# Altium schematic sheet uARM.SchDoc
size B
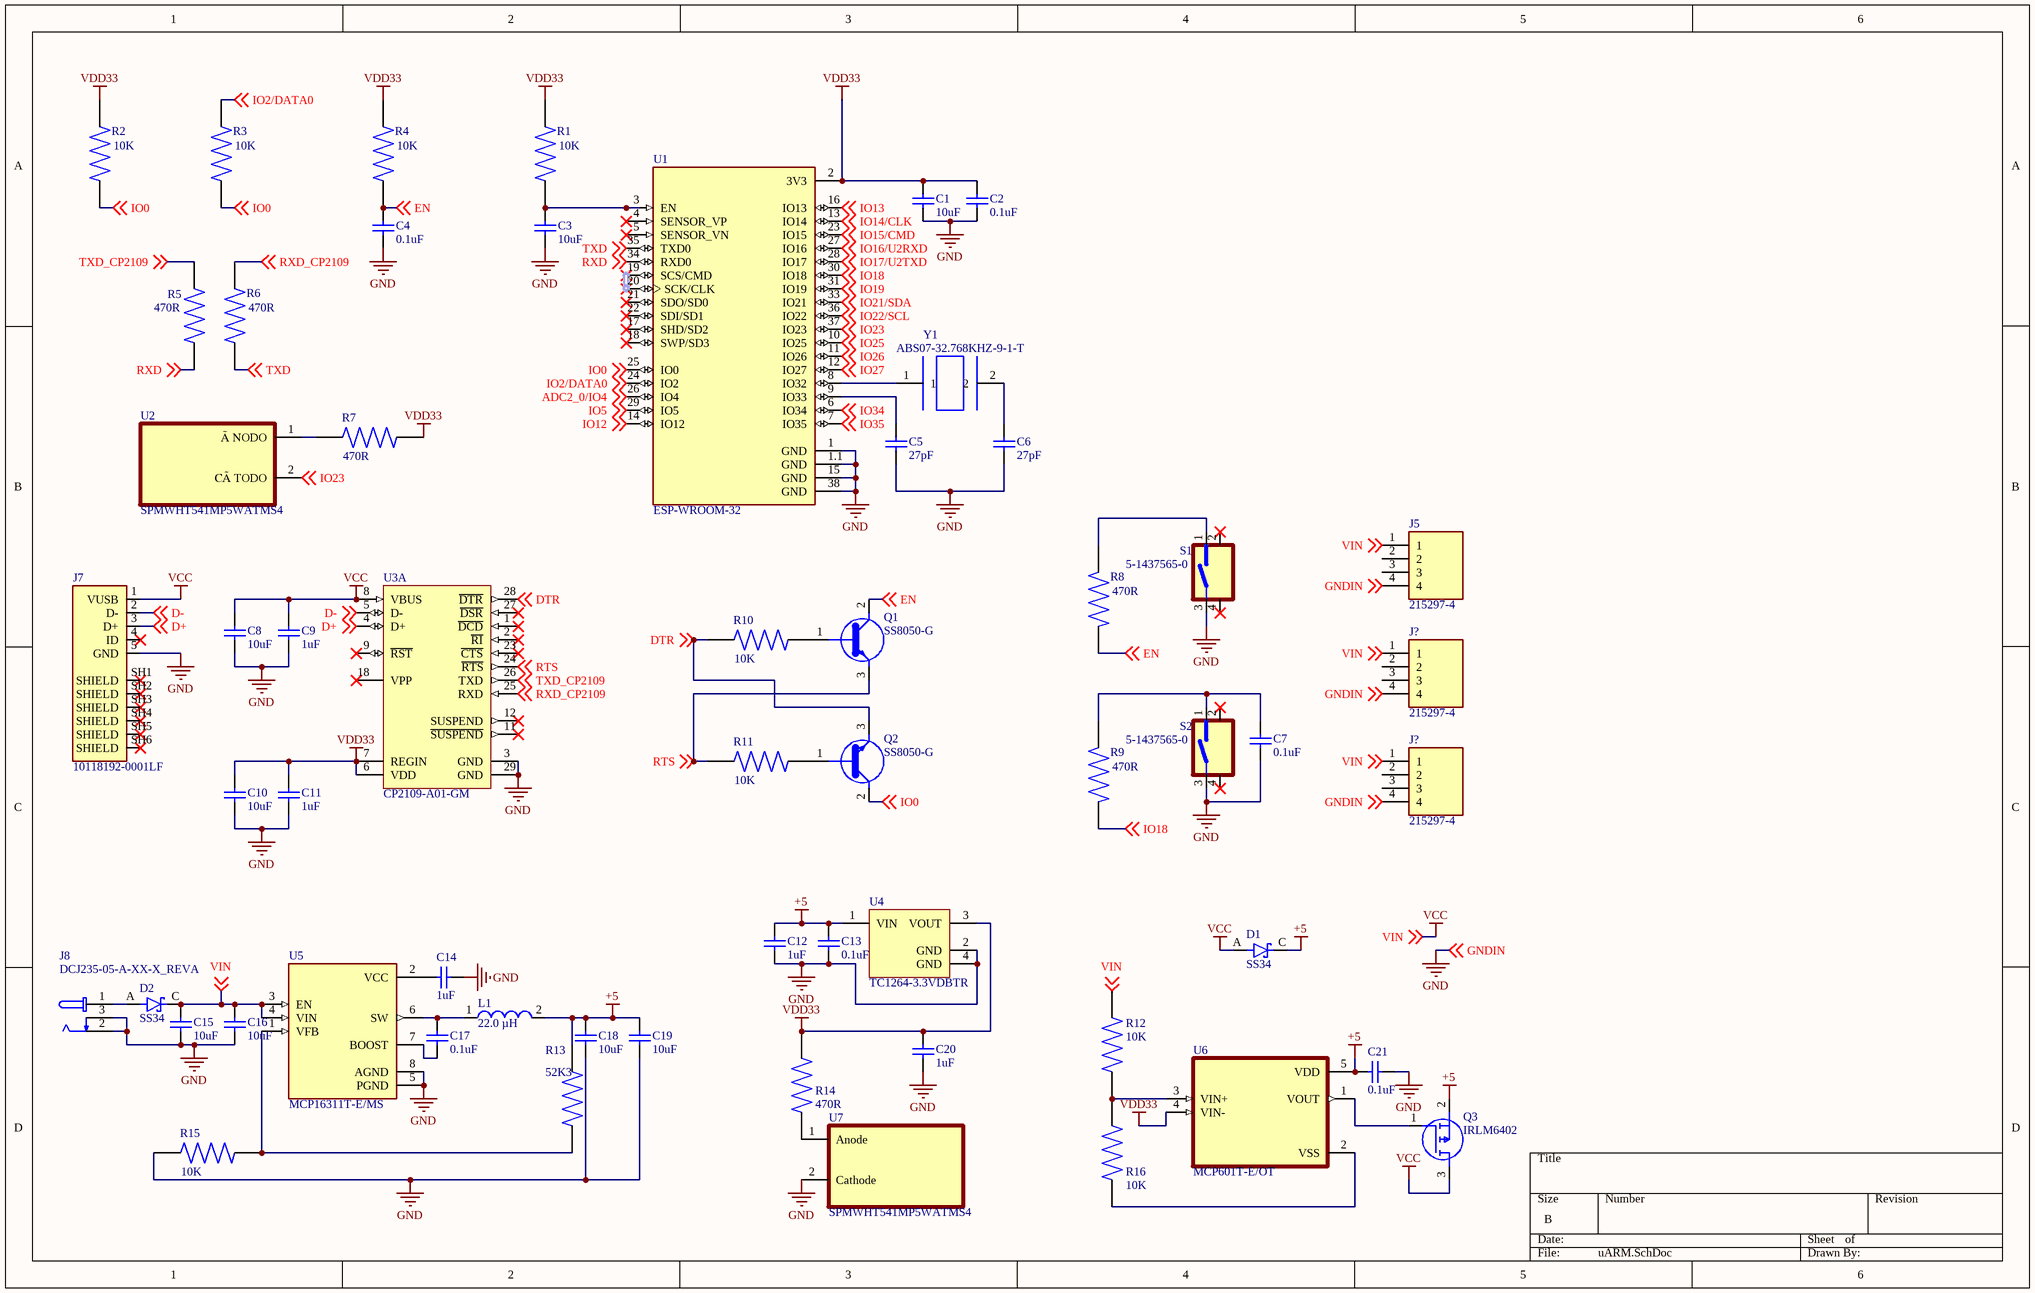
[diagram p0: uARM.SchDoc]

## Parts
(Parts that share a designator on the sheet are numbered #1, #2 ... from top to bottom, then left to right.)
C1  value 10uF  [C_3216[1206]_N]  (hidden comment: C1206C106K3RACTU)
C2  value 0.1uF  [C_3216[1206]_N]  (hidden comment: C1206C106K3RACTU)
C3  value 10uF  [C_3216[1206]_N]  (hidden comment: C1206C106K3RACTU)
C4  value 0.1uF  [C_3216[1206]_N]  (hidden comment: C1206C106K3RACTU)
C5  value 27pF  [C_3216[1206]_N]  (hidden comment: C1206C106K3RACTU)
C6  value 27pF  [C_3216[1206]_N]  (hidden comment: C1206C106K3RACTU)
C7  value 0.1uF  [C_3216[1206]_N]  (hidden comment: C1206C106K3RACTU)
C8  value 10uF  [C_3216[1206]_N]  (hidden comment: C1206C106K3RACTU)
C9  value 1uF  [C_3216[1206]_N]  (hidden comment: C1206C106K3RACTU)
C10  value 10uF  [C_3216[1206]_N]  (hidden comment: C1206C106K3RACTU)
C11  value 1uF  [C_3216[1206]_N]  (hidden comment: C1206C106K3RACTU)
C12  value 1uF  [C_3216[1206]_N]  (hidden comment: C1206C106K3RACTU)
C13  value 0.1uF  [C_3216[1206]_N]  (hidden comment: C1206C106K3RACTU)
C14  value 1uF  [C_3216[1206]_N]  (hidden comment: C1206C106K3RACTU)
C15  value 10uF  [C_3216[1206]_N]  (hidden comment: C1206C106K3RACTU)
C16  value 10uF  [C_3216[1206]_N]  (hidden comment: C1206C106K3RACTU)
C17  value 0.1uF  [C_3216[1206]_N]  (hidden comment: C1206C106K3RACTU)
C18  value 10uF  [C_3216[1206]_N]  (hidden comment: C1206C106K3RACTU)
C19  value 10uF  [C_3216[1206]_N]  (hidden comment: C1206C106K3RACTU)
C20  value 1uF  [C_3216[1206]_N]  (hidden comment: C1206C106K3RACTU)
C21  value 0.1uF  [C_3216[1206]_N]  (hidden comment: C1206C106K3RACTU)
D1  SS34  [DIOM7959X265N]
D2  SS34  [DIOM7959X265N]
J5  215297-4  [TE_215297-4]
J7  10118192-0001LF  [AMPHENOL_10118192-0001LF]
J8  DCJ235-05-A-XX-X_REVA  [GCT_DCJ235-05-A-XX-X_REVA]
J?#1  215297-4  [TE_215297-4]
J?#2  215297-4  [TE_215297-4]
L1  Inductance: 22.0 µH  [WE-PD2-S]  (hidden comment: 744773122)
Q1  SS8050-G  [MBTB-T-SOT23]
Q2  SS8050-G  [MBTB-T-SOT23]
Q3  IRLM6402  [SOT95P237X112-3N]
R1  value 10K  [RESC1608X55N]  (hidden comment: CRG0603F10K/10)
R2  value 10K  [RESC1608X55N]  (hidden comment: CRG0603F10K/10)
R3  value 10K  [RESC1608X55N]  (hidden comment: CRG0603F10K/10)
R4  value 10K  [RESC1608X55N]  (hidden comment: CRG0603F10K/10)
R5  value 470R  [RESC1608X55N]  (hidden comment: ERJ-S03F4700V)
R6  value 470R  [RESC1608X55N]  (hidden comment: ERJ-S03F4700V)
R7  value 470R  [RESC1608X55N]  (hidden comment: ERJ-S03F4700V)
R8  value 470R  [RESC1608X55N]  (hidden comment: ERJ-S03F4700V)
R9  value 470R  [RESC1608X55N]  (hidden comment: ERJ-S03F4700V)
R10  value 10K  [RESC1608X55N]  (hidden comment: CRG0603F10K/10)
R11  value 10K  [RESC1608X55N]  (hidden comment: CRG0603F10K/10)
R12  value 10K  [RESC1608X55N]  (hidden comment: CRG0603F10K/10)
R13  value 52K3  [RESC0603X26N]  (hidden comment: ERJ-1GEF5232C)
R14  value 470R  [RESC1608X55N]  (hidden comment: ERJ-S03F4700V)
R15  value 10K  [RESC1608X55N]  (hidden comment: CRG0603F10K/10)
R16  value 10K  [RESC1608X55N]  (hidden comment: CRG0603F10K/10)
S1  5-1437565-0  [SW_5-1437565-0]
S2  5-1437565-0  [SW_5-1437565-0]
U1  ESP-WROOM-32  [MODULE_ESP-WROOM-32]
U2  SPMWHT541MP5WATMS4  [LED_SPMWHT541MP5WAPKS4]
U3  CP2109-A01-GM  [SLAB-QFN-28-3125x3125TP_L]  (part A of 2)
U4  TC1264-3.3VDBTR  [SOT-223-DB3_L]
U5  MCP16311T-E/MS  [SOP65P490X110-8N]
U6  MCP601T-E/OT  [SOT95P270X145-5N]
U7  SPMWHT541MP5WATMS4  [LED_SPMWHT541MP5WAPKS4]
Y1  ABS07-32.768KHZ-9-1-T  [XTAL320X150X90]

## Nets
+5: C12.1 C13.2 C18.2 C19.2 C21.2 D1.C(K) L1.2 Q3.2(S) R13.2 U4.1(VIN) U6.5(VDD)
GND: C1.1 C2.1 C3.2 C4.1 C5.1 C6.1 C7.1 C8.1 C9.1 C10.1 C11.1 C12.2 C13.1 C14.1 C15.1 C16.1 C18.1 C19.1 C20.2 C21.1 J5.4 J7.5(GND) J8.2 J8.3 J?#1.4 J?#2.4 R15.1 S1.3 S2.3 U1.1(GND) U1.1.1(GND) U1.15(GND) U1.38(GND) U3.3(GND) U3.29(GND) U4.2(GND) U4.4(GND) U5.5(PGND) U5.8(AGND) U7.2(Cathode) ; off-sheet GNDIN  [also labelled GNDIN]
VCC: C8.2 C9.2 C15.2 C16.2 D1.A D2.C(K) J5.1 J7.1(VUSB) J?#1.1 J?#2.1 Q3.3(D) R12.1 U3.8(VBUS) U5.3(EN) U5.4(VIN) ; off-sheet VIN  [also labelled VIN]
VDD33: C1.2 C2.2 C10.2 C11.2 C20.1 R1.2 R2.1 R4.1 R7.1 R14.2 U1.2(3V3) U3.6(VDD) U3.7(REGIN) U4.3(VOUT) U6.4(VIN-)
ADC2_0/IO4: U1.26(IO4) ; off-sheet ADC2_0/IO4
D+: J7.3(D+) U3.4(D+) ; off-sheet D+
D-: J7.2(D-) U3.5(D-) ; off-sheet D-
DTR: Q2.3(C) R10.2 U3.28(~{DTR}) ; off-sheet DTR
EN: C4.2 Q1.2(E) R4.2 R8.2 ; off-sheet EN
IO0: Q2.2(E) R2.2 R3.2 U1.25(IO0) ; off-sheet IO0
IO2/DATA0: R3.1 U1.24(IO2) ; off-sheet IO2/DATA0
IO5: U1.29(IO5) ; off-sheet IO5
IO12: U1.14(IO12) ; off-sheet IO12
IO13: U1.16(IO13) ; off-sheet IO13
IO14/CLK: U1.13(IO14) ; off-sheet IO14/CLK
IO15/CMD: U1.23(IO15) ; off-sheet IO15/CMD
IO16/U2RXD: U1.27(IO16) ; off-sheet IO16/U2RXD
IO17/U2TXD: U1.28(IO17) ; off-sheet IO17/U2TXD
IO18: R9.2 U1.30(IO18) ; off-sheet IO18
IO19: U1.31(IO19) ; off-sheet IO19
IO21/SDA: U1.33(IO21) ; off-sheet IO21/SDA
IO22/SCL: U1.36(IO22) ; off-sheet IO22/SCL
IO23: U1.37(IO23) U2.2(CÃTODO) ; off-sheet IO23
IO25: U1.10(IO25) ; off-sheet IO25
IO26: U1.11(IO26) ; off-sheet IO26
IO27: U1.12(IO27) ; off-sheet IO27
IO34: U1.6(IO34) ; off-sheet IO34
IO35: U1.7(IO35) ; off-sheet IO35
RTS: Q1.3(C) R11.2 U3.24(~{RTS}) ; off-sheet RTS
RXD: R5.1 U1.34(RXD0) ; off-sheet RXD
RXD_CP2109: R6.2 U3.25(RXD) ; off-sheet RXD_CP2109
TXD: R6.1 U1.35(TXD0) ; off-sheet TXD
TXD_CP2109: R5.2 U3.26(TXD) ; off-sheet TXD_CP2109
NetC3_1: C3.1 R1.1 U1.3(EN)
NetC5_2: C5.2 U1.9(IO33)
NetC6_2: C6.2 Y1.2
NetC7_2: C7.2 R9.1 S2.1
NetC14_2: C14.2 U5.2(VCC)
NetC17_1: C17.1 U5.7(BOOST)
NetC17_2: C17.2 L1.1 U5.6(SW)
NetD2_A: D2.A J8.1
NetQ1_1: Q1.1(B) R10.1
NetQ2_1: Q2.1(B) R11.1
NetQ3_1: Q3.1(G) U6.1(VOUT)
NetR7_2: R7.2 U2.1(ÃNODO)
NetR8_1: R8.1 S1.1
NetR12_2: R12.2 R16.1 U6.3(VIN+)
NetR13_1: R13.1 R15.2 U5.1(VFB)
NetR14_1: R14.1 U7.1(Anode)
NetR16_2: R16.2 U6.2(VSS)
NetU1_8: U1.8(IO32) Y1.1

Not connected (* = marked no-connect by the designer): J5 2 3; J7 4(ID)* SH1(SHIELD)* SH2(SHIELD)* SH3(SHIELD)* SH4(SHIELD)* SH5(SHIELD)* SH6(SHIELD)*; J?#1 2 3; J?#2 2 3; S1 2* 4(1)*; S2 2* 4(1)*; U1 4(SENSOR_VP)* 5(SENSOR_VN)* 17(SHD/SD2)* 18(SWP/SD3)* 19(SCS/CMD)* 20(SCK/CLK)* 21(SDO/SD0)* 22(SDI/SD1)*; U3 1(~{DCD})* 2(~{RI})* 9(~{RST})* 11(~{SUSPEND})* 12(SUSPEND)* 18(VPP)* 23(~{CTS})* 27(~{DSR})*

## Library data of the parts
C1-C21 = C_10uf_3216[1206]: Capacitor Céramique 10uf XR7 25V 10%; Manufacturer: KEMET; ManufacturerPartNumber: C1206C106K3RACTU; Supplier 1: Digi-Key; Supplier Part Number 1: 399-7442-1-ND; MountingType: SMT
D1 D2 = SS34: Diode Schottky 40V 3A 2-Pin SMC T/R; MF: {'manufacturer': u'ON Semiconductor'}; Availability: Unavailable; Package: None; MP: SS34; Value: *; Price: None
J5 J?#1 J?#2 = 215297-4: MF: {'manufacturer': u'TE Connectivity'}; Package: None; Price: None; Availability: Unavailable; MP: 215297-4; Value: *
J7 = 10118192-0001LF: Single Port 5 Contact Horizontal Right Angle Shielded Micro B USB 2.0 Connector; MF: {'manufacturer': u'FCI'}; Package: None; MP: 10118192-0001LF; Price: None; Value: *; Availability: Unavailable
J8 = DCJ235-05-A-XX-X_REVA: DC Power Jack, Thru-Hole, Horizontal, with Locating Pegs, D2.35mm; MF: {'manufacturer': u'Global Connector Technology'}; Availability: Unavailable; Package: None; Price: None; MP: DCJ235-05-A-XX-X_REVA; Value: *
L1 = 744773122: SMD Power Inductor WE-PD2, L = 22.0 µH; ComponentLink1Description: Manufacturer Link; ComponentLink2Description: Datasheet; DatasheetVersion: ver 1, Oct-2004; ComponentLink1URL: http://www.we-online.com; PackageVersion: 2004; PackageDescription: SMD Inductor, 2-Leads, Body 4.5 x 4.0 mm; ComponentLink2URL: http://www.we-online.de/katalog/media/pdf/744773122.pdf; PackageReference: WE-PD2-S; PartNumber: 744773122
Q1 Q2 = SS8050-G: <b>Bipolar Transistors - BJT NPN TRANSISTOR 1.5A 40V</b><p> Source: <a href="https://componentsearchengine.com/Datasheets/1/SS8050-G.pdf"> Datasheet </a>; MF: {'manufacturer': u'Comchip Technology'}; Package: None; Value: *; MP: SS8050-G; Availability: Unavailable; Price: None
Q3 = IRLM6402: MOSFET (P-Channel); Manufacturer_Name: Infineon; Datasheet Link: https://www.kynix.com/Detail/613549/IRLM6402.html; Height: 1.12mm; Manufacturer_Part_Number: IRLM6402
R1-R4 R10-R12 R15 R16 = CRG0603F10K/10: Thick Film Resistors - SMD CRG0603 1% 10K 10K RL; MF: {'manufacturer': u'TE Connectivity'}; Price: None; MP: CRG0603F10K/10; Package: None; Availability: Unavailable
R5-R9 R14 = ERJ-S03F4700V: MF: {'manufacturer': u'Panasonic'}; Package: None; Price: None; MP: ERJ-S03F4700V; Availability: Unavailable
R13 = ERJ-1GEF5232C: Res Thick Film 0201 52.3K Ohm 1% 0.05W(1/20W) Â±200ppm/C SMD T/R; MF: {'manufacturer': u'Panasonic'}; Package: None; MP: ERJ-1GEF5232C; Availability: Unavailable; Price: None
S1 S2 = 5-1437565-0: Switch Tactile OFF (ON) Round Button Gull Wing 0.05A 12VDC 1.57N SMD T/R; MF: {'manufacturer': u'TE Connectivity'}; MP: 5-1437565-0; Package: None; Price: None; Value: *; Availability: Unavailable
U1 = ESP-WROOM-32: Module: combo; GPIO, I2C x2, I2S x2, SDIO, SPI x3, UART x3; 19.5dBm; MF: {'manufacturer': u'Espressif Systems'}; Availability: Unavailable; MP: ESP-WROOM-32; Value: *; Price: None; Package: None
U2 U7 = SPMWHT541MP5WATMS4: MF: {'manufacturer': u'Samsung Semiconductor,'}; Package: None; Value: *; MP: SPMWHT541MP5WATMS4; Availability: Unavailable; Price: None
U3 = CP2109-A01-GM: Single-Chip USB to UART Bridge, 1024 Bytes EEPROM, -40 to 85 degC, 28-pin QFN, Tube; Manufacturer: Silicon Labs; Sub-Family: USB Bridges; Internal Oscillator: TRUE; ComponentLink1Description: Manufacturer URL; ComponentLink2Description: Datasheet; PartNumber: CP2109-A01-GM; ComponentLink3Description: Package Specification; ComponentLink3URL: http://www.silabs.com/Support%20Documents/TechnicalDocs/C8051T61x.pdf; DatasheetVersion: Rev. 1.5; ComponentLink1URL: http://www.silabs.com/; ComponentLink2URL: http://www.silabs.com/Support%20Documents/TechnicalDocs/CP2102-9.pdf; Code_IPC: J-STD-020C; Mounting Technology: Surface Mount; PackageDescription: 28-Pin Quad-Flat No-Leads Package, Body 5 x 5 mm, Pitch 0.5 mm; Code_JEDEC: MO-220; EEPROM: 1024 Bytes; PackageReference: QFN-28
U4 = TC1264-3.3VDBTR: 800 mA Fixed-Output CMOS LDO with Shutdown, 3-Pin SOT-223, Extended Temperature, Tape and Reel; PackageVersion: revBB, Aug-2009; PackageReference: SOT-223-DB3; PackageDescription: 3-Lead Plastic Small Outline Transistor (DB) [SOT-223]; DatasheetVersion: revC, Oct-2006; PartNumber: TC1264-3.3VDBTR
U5 = MCP16311T-E/MS: The MCP16311/2 is a compact, high-efficiency, fixed frequency, synchronous step-down DC-DC converter in an 8-pin MSOP, or 2 x 3 TDFN package that operates from input voltage sources up to 30V. Integrated features include a high-side and a low-side switch, fixed frequency peak current mode control, internal compensation, peak current limit and overtemperature protection. The MCP16311/2 provides all the active functions for local DC-DC conversion, with fast transient response and accurate regulation.; MF: {'manufacturer': u'Microchip Technology'}; MP: MCP16311T-E/MS; Value: *; Package: None; Price: None; Availability: Unavailable
U6 = MCP601T-E/OT: MF: {'manufacturer': u'Microchip'}; Package: None; MP: MCP601T-E/OT; Price: None; Value: *; Availability: Unavailable
Y1 = ABS07-32.768KHZ-9-1-T: ABS07 Series 32.768 kHz Â±20 ppm 12.5 pF -40 to +85 C SMT Low Profile Crystal; MF: {'manufacturer': u'Abracon'}; Package: None; MP: ABS07-32.768KHZ-9-1-T; Price: None; Value: *; Availability: Unavailable